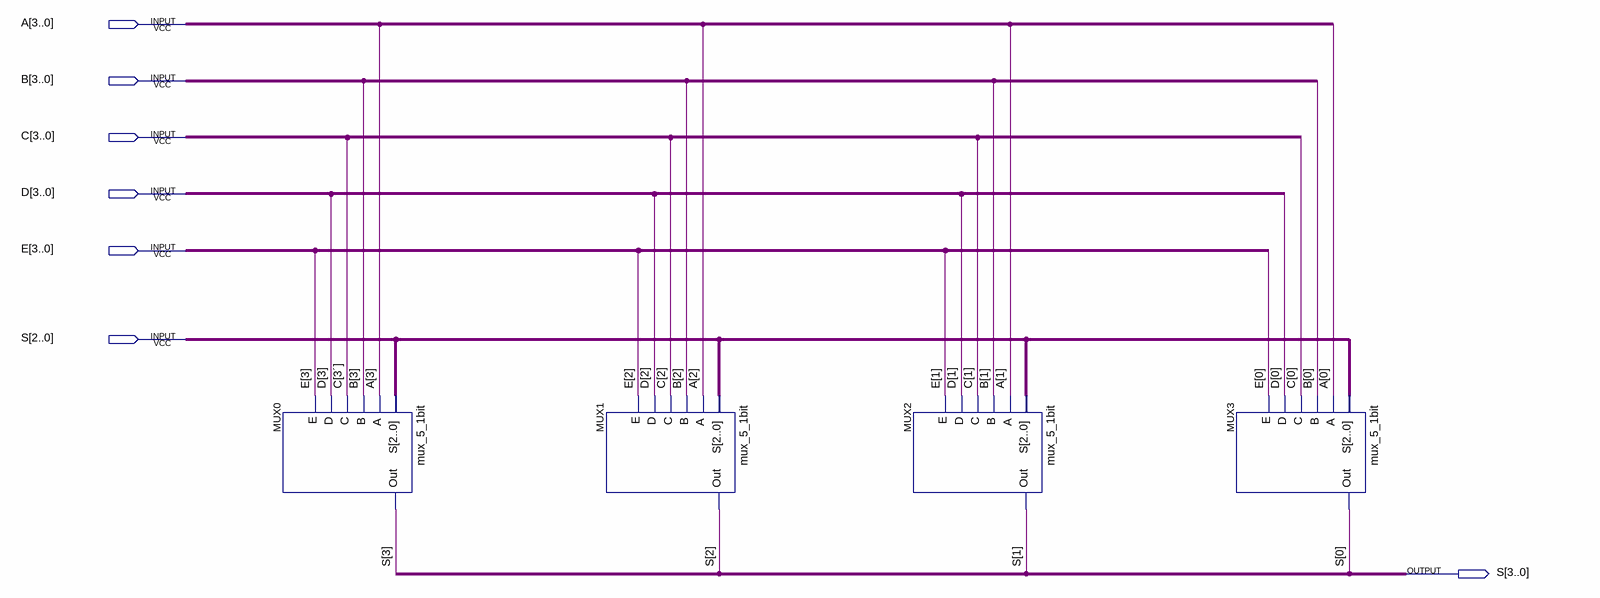
[diagram p0: schematic sheet]
// Quartus schematic mux_5_4bit.bdf as structural Verilog: 4 symbols, 7 pins
module mux_5_4bit (
  input  [3:0] A,
  input  [3:0] B,
  input  [3:0] C,
  input  [3:0] D,
  input  [3:0] E,
  inout  [3:0] S
);

  wire \C[3´] ;

  mux_5_1bit MUX0 (.S(S[2:0]), .A(A[3]), .B(B[3]), .C(\C[3´] ), .D(D[3]), .E(E[3]), .Out(S[3]));
  mux_5_1bit MUX1 (.S(S[2:0]), .A(A[2]), .B(B[2]), .C(C[2]), .D(D[2]), .E(E[2]), .Out(S[2]));
  mux_5_1bit MUX2 (.S(S[2:0]), .A(A[1]), .B(B[1]), .C(C[1]), .D(D[1]), .E(E[1]), .Out(S[1]));
  mux_5_1bit MUX3 (.S(S[2:0]), .A(A[0]), .B(B[0]), .C(C[0]), .D(D[0]), .E(E[0]), .Out(S[0]));
endmodule
